# EAGLE design Relay 4 Channel (EAGLE 7.2.0)
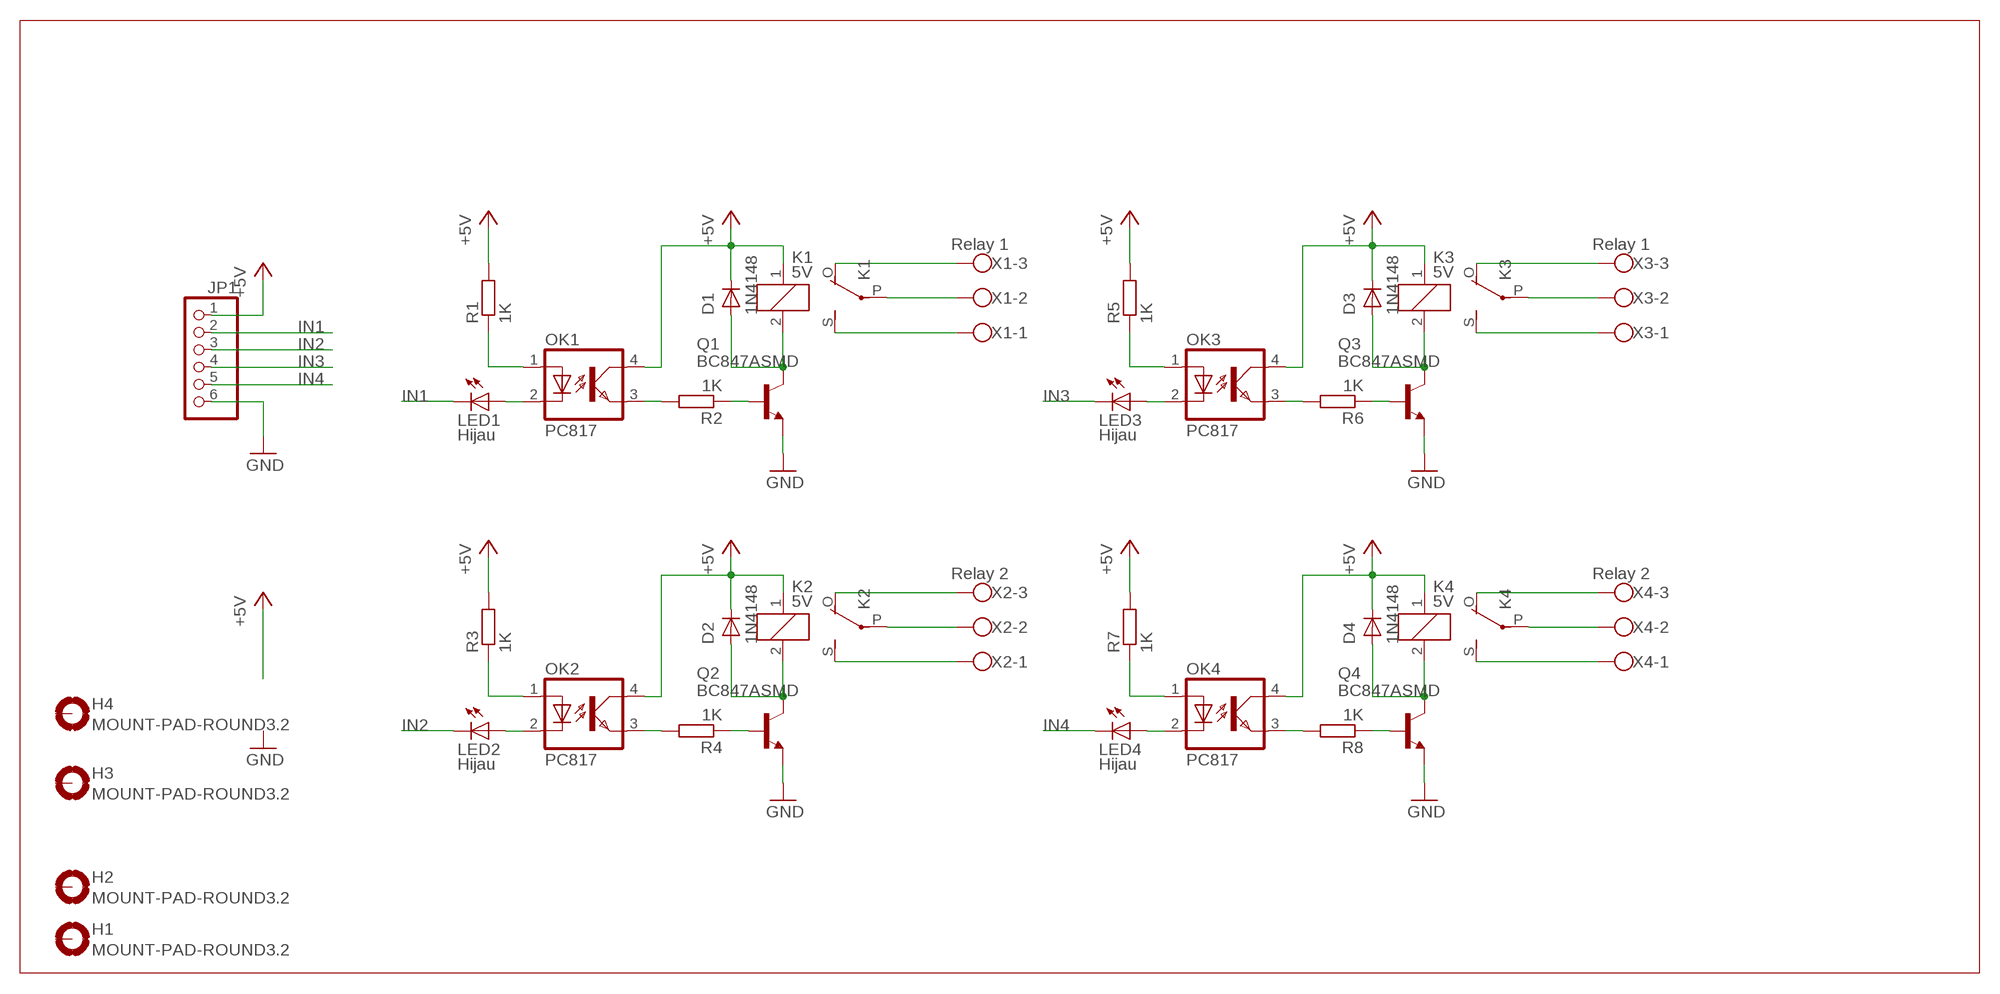
[diagram p0: schematic, sheet 1]

## Parts
D1  1N4148  GF1  [SMA-DO214AC]
D2  1N4148  GF1  [SMA-DO214AC]
D3  1N4148  GF1  [SMA-DO214AC]
D4  1N4148  GF1  [SMA-DO214AC]
H1  MOUNT-PAD-ROUND3.2  [3,2-PAD]
H2  MOUNT-PAD-ROUND3.2  [3,2-PAD]
H3  MOUNT-PAD-ROUND3.2  [3,2-PAD]
H4  MOUNT-PAD-ROUND3.2  [3,2-PAD]
JP1  PINHD-1X6  [1X06]
K1  5V  ZF112  [ZF112]
K2  5V  ZF112  [ZF112]
K3  5V  ZF112  [ZF112]
K4  5V  ZF112  [ZF112]
LED1  Hijau  LED3MM  [LED3MM]
LED2  Hijau  LED3MM  [LED3MM]
LED3  Hijau  LED3MM  [LED3MM]
LED4  Hijau  LED3MM  [LED3MM]
OK1  PC817  [DIL04]
OK2  PC817  [DIL04]
OK3  PC817  [DIL04]
OK4  PC817  [DIL04]
Q1  BC847ASMD  [SOT23]
Q2  BC847ASMD  [SOT23]
Q3  BC847ASMD  [SOT23]
Q4  BC847ASMD  [SOT23]
R1  1K  R-EU_R1206  [R1206]
R2  1K  R-EU_R1206  [R1206]
R3  1K  R-EU_R1206  [R1206]
R4  1K  R-EU_R1206  [R1206]
R5  1K  R-EU_R1206  [R1206]
R6  1K  R-EU_R1206  [R1206]
R7  1K  R-EU_R1206  [R1206]
R8  1K  R-EU_R1206  [R1206]
X1  Relay 1  W237-103  [W237-103]
X2  Relay 2  W237-103  [W237-103]
X3  Relay 1  W237-103  [W237-103]
X4  Relay 2  W237-103  [W237-103]

## Nets
+5V: D1.K(C) D2.K(C) D3.K(C) D4.K(C) JP1.1 K1.1 K2.1 K3.1 K4.1 OK1.4(COL) OK2.4(COL) OK3.4(COL) OK4.4(COL) R1.2 R3.2 R5.2 R7.2
GND: JP1.6 Q1.2(E) Q2.2(E) Q3.2(E) Q4.2(E)
IN1: JP1.2 LED1.K(C)
IN2: JP1.3 LED2.K(C)
IN3: JP1.4 LED3.K(C)
IN4: JP1.5 LED4.K(C)
N$1: LED1.A OK1.2(C)
N$2: K1.O(2:O) X1.3
N$3: K1.P(2:P) X1.2
N$4: K1.S(2:S) X1.1
N$5: OK1.1(A) R1.1
N$6: LED3.A OK3.2(C)
N$7: OK1.3(EMIT) R2.2
N$8: D1.A K1.2 Q1.3(C)
N$9: Q1.1(B) R2.1
N$10: LED2.A OK2.2(C)
N$11: K2.O(2:O) X2.3
N$12: K2.P(2:P) X2.2
N$13: K2.S(2:S) X2.1
N$14: OK2.1(A) R3.1
N$15: K3.O(2:O) X3.3
N$16: OK2.3(EMIT) R4.2
N$17: D2.A K2.2 Q2.3(C)
N$18: Q2.1(B) R4.1
N$19: K3.P(2:P) X3.2
N$20: K3.S(2:S) X3.1
N$21: OK3.1(A) R5.1
N$22: OK3.3(EMIT) R6.2
N$23: D3.A K3.2 Q3.3(C)
N$24: Q3.1(B) R6.1
N$25: LED4.A OK4.2(C)
N$26: K4.O(2:O) X4.3
N$27: K4.P(2:P) X4.2
N$28: K4.S(2:S) X4.1
N$29: OK4.1(A) R7.1
N$30: OK4.3(EMIT) R8.2
N$31: D4.A K4.2 Q4.3(C)
N$32: Q4.1(B) R8.1
Unconnected: H1.B3,2(MOUNT) H2.B3,2(MOUNT) H3.B3,2(MOUNT) H4.B3,2(MOUNT)

## Library data of the parts
D1-D4 = diode:GF1: DIODE
H1-H4 = holes:MOUNT-PAD-ROUND: MOUNTING PAD, round
JP1 = pinhead:PINHD-1X6: PIN HEADER
K1-K4 = relay:ZF112: RELAY 1 x switch; OC_FARNELL: unknown; OC_NEWARK: unknown
LED1-LED4 = led:LED: LED OSRAM: - CHIPLED LG R971, LG N971, LY N971, LG Q971, LY Q971, LO R971, LY R971 LH N974, LH R974 LS Q976, LO Q976, LY Q976 LO Q996 - Hyper CHIPLED LW Q18S LB Q993, LB Q99A, LB R99A - SideLED LS A670, LO A670, LY A670, LG A670, LP A670 LB A673, LV A673, LT A673, LW A673 LH A674 LY A675 LS A676, LA A676, LO A676, LY A676, LW A676 LS A679, LY A679, LG A679 - Hyper Micro SIDELED® LS Y876, LA Y876, LO Y876, LY Y876 LT Y87S - SmartLED LW L88C, LW L88S LB L89C, LB L89S, LG L890 LS L89K, LO L89K, LY L89K LS L896, LA L896, LO L896, LY L896 - TOPLED LS T670, LO T670, LY T670, LG T670, LP T670 LSG T670, LSP T670, LSY T670, LOP T670, LYG T670 LG T671, LOG T671, LSG T671 LB T673, LV T673, LT T673, LW T673 LH T674 LS T676, LA T676, LO T676, LY T676, LB T676, LH T676, LSB T676, LW T676 LB T67C, LV T67C, LT T67C, LS T67K, LO T67K, LY T67K, LW E67C LS E67B, LA E67B, LO E67B, LY E67B, LB E67C, LV E67C, LT E67C LW T67C LS T679, LY T679, LG T679 LS T770, LO T770, LY T770, LG T770, LP T770 LB T773, LV T773, LT T773, LW T773 LH T774 LS E675, LA E675, LY E675, LS T675 LS T776, LA T776, LO T776, LY T776, LB T776 LHGB T686 LT T68C, LB T68C - Hyper Mini TOPLED® LB M676 - Mini TOPLED Santana® LG M470 LS M47K, LO M47K, LY M47K Source: http://www.osram.convergy.de LUXEON: - LUMILED® LXK2-PW12-R00, LXK2-PW12-S00, LXK2-PW14-U00, LXK2-PW14-V00 LXK2-PM12-R00, LXK2-PM12-S00, LXK2-PM14-U00 LXK2-PE12-Q00, LXK2-PE12-R00, LXK2-PE12-S00, LXK2-PE14-T00, LXK2-PE14-U00 LXK2-PB12-K00, LXK2-PB12-L00, LXK2-PB12-M00, LXK2-PB14-N00, LXK2-PB14-P00, LXK2-PB14-Q00 LXK2-PR12-L00, LXK2-PR12-M00, LXK2-PR14-Q00, LXK2-PR14-R00 LXK2-PD12-Q00, LXK2-PD12-R00, LXK2-PD12-S00 LXK2-PH12-R00, LXK2-PH12-S00 LXK2-PL12-P00, LXK2-PL12-Q00, LXK2-PL12-R00 Source: www.luxeon.com KINGBRIGHT: KA-3528ASYC Source: www.kingbright.com
OK1-OK4 = optocoupler:PC817: SHARP OPTO COUPLER; MPN: PC817X4J000F; OC_FARNELL: 9707727; OC_NEWARK: 97K7059
Q1-Q4 = transistor-npn:BC847*: NPN Transistor
R1-R8 = rcl:R-EU_: RESISTOR, European symbol
X1-X4 = con-wago-500:W237-103: WAGO SCREW CLAMP; MPN: 237-103; OC_FARNELL: unknown; OC_NEWARK: 18M7116

## Board
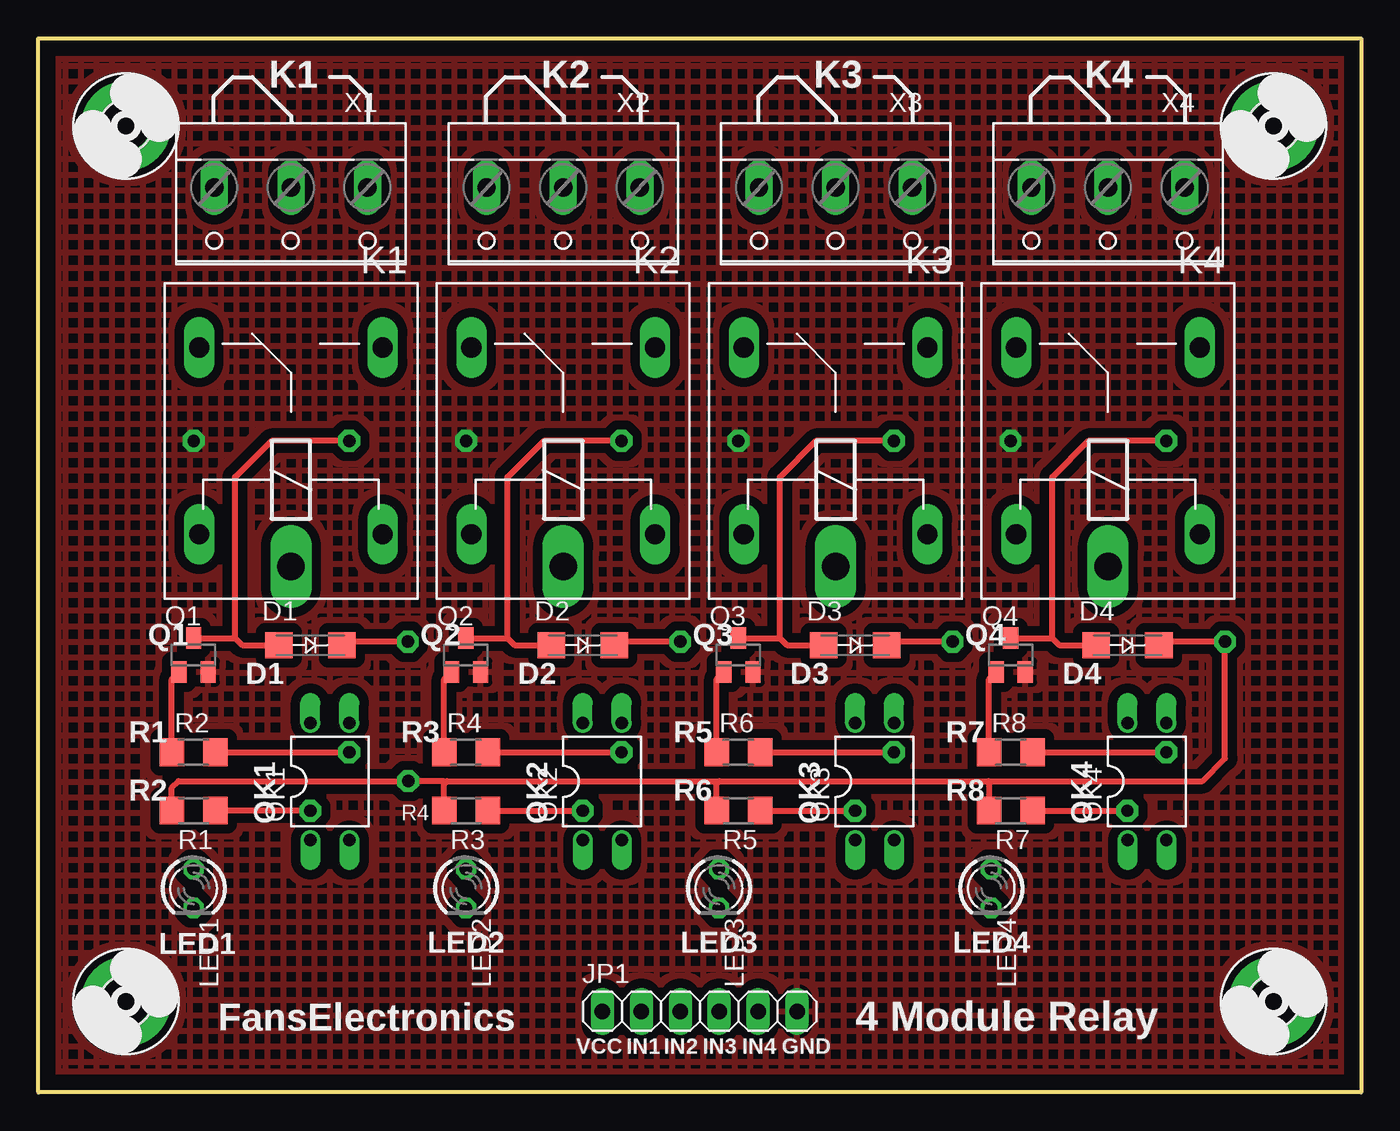
[diagram p1: board, top side]
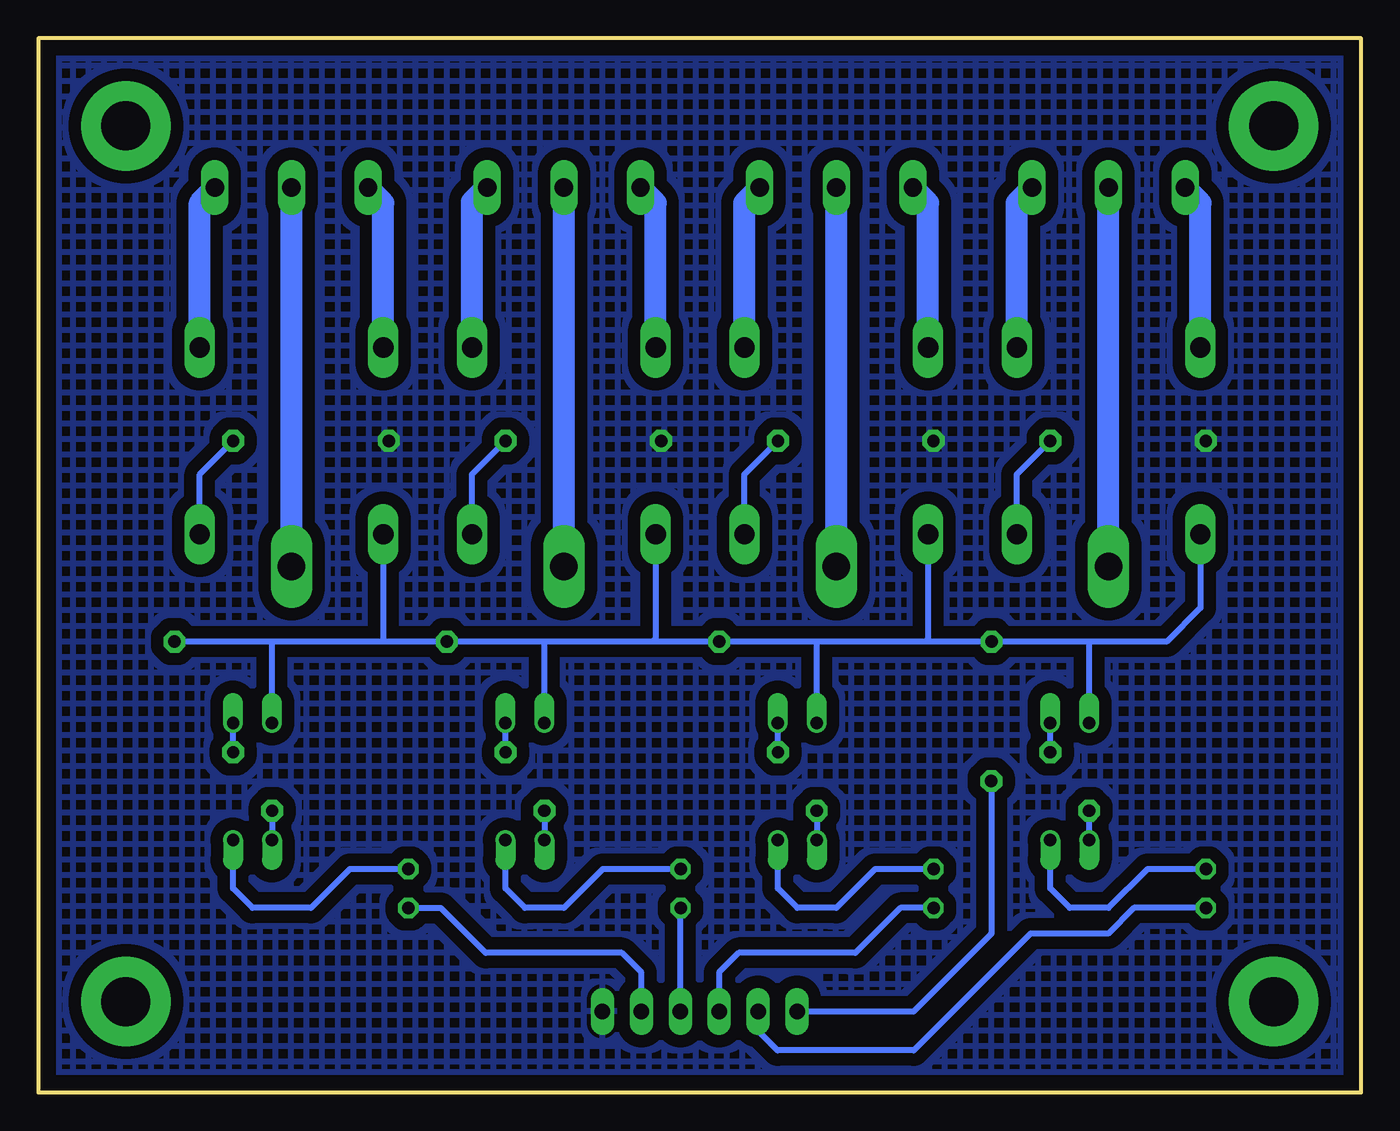
[diagram p2: board, bottom side, seen from below]

Size 86.36 x 68.78 mm. Coordinates in mm from the lower left corner, seen from the top.
Outline: 0,0 0,68.78 86.36,68.78 86.36,0 0,0
Copper layers (1*16): Top 0.035mm / dielectric 1.5mm / Bottom 0.035mm
Design rules "default": minimum track width 10mil, minimum drill 24mil, track to track 8mil, track to pad 8mil, pad to pad 8mil, via to via 8mil, smd to smd 8mil, copper to edge 40mil, drill to drill 8mil, minimum pad ring 10mil, minimum via ring 8mil, stop-mask expansion 4mil, vias tented up to drill 0mil, thermal gap 10mil

### Footprints (pad centres in the part's own frame; a part is rotated, then mirrored left to right if it is on the bottom)
SMA-DO214AC = smd 1.8 x 1.7: A -2.05,0; K 2.05,0
3,2-PAD = drill 3.2 pad 5.842: B3,2 0,0
1X06 = drill 1.016 long: 1 -6.35,0; 2 -3.81,0; 3 -1.27,0; 4 1.27,0; 5 3.81,0; 6 6.35,0
ZF112 = drill 1.321 long: 1 -6.096,5.994; 2 -6.096,-5.994; O 6.096,5.994; S 6.096,-5.994 | drill 1.803 long: P -8.204,0
LED3MM = drill 0.813 octagon: A -1.27,0; K 1.27,0
DIL04 = drill 0.813 offset: 1 -1.27,-3.81; 2 1.27,-3.81; 3 1.27,3.81; 4 -1.27,3.81
SOT23 = smd 1 x 1.4: 1 -0.95,-1.1; 2 0.95,-1.1; 3 0,1.1
R1206 = smd 1.6 x 1.803: 1 -1.422,0; 2 1.422,0
W237-103 = drill 1.194 long: 1 -5,-1.29; 2 0,-1.29; 3 5,-1.29

### Placement (x,y rotation side)
D1  17.76,29.17 0 top
D2  35.54,29.17 0 top
D3  53.32,29.17 0 top
D4  71.1,29.17 0 top
H1  5.71,5.91 0 top
H2  80.65,5.91 0 top
H3  5.71,63.06 0 top
H4  80.65,63.06 0 top
JP1  43.18,5.28 0 top
K1  16.49,42.51 90 top
K2  34.27,42.51 90 top
K3  52.05,42.51 90 top
K4  69.83,42.51 90 top
LED1  10.14,13.3 270 top
LED2  27.92,13.3 270 top
LED3  44.43,13.3 270 top
LED4  62.21,13.3 270 top
OK1  19.03,20.28 0 top
OK2  36.81,20.28 0 top
OK3  54.59,20.28 0 top
OK4  72.37,20.28 0 top
Q1  10.14,28.54 0 top
Q2  27.92,28.54 0 top
Q3  45.7,28.54 0 top
Q4  63.48,28.54 0 top
R1  10.14,18.38 180 top
R2  10.14,22.19 0 top
R3  27.92,18.38 180 top
R4  27.92,22.19 0 top
R5  45.7,18.38 180 top
R6  45.7,22.19 0 top
R7  63.48,18.38 180 top
R8  63.48,22.19 0 top
X1  16.49,57.75 180 top
X2  34.27,57.75 180 top
X3  52.05,57.75 180 top
X4  69.83,57.75 180 top

### Tracks (layer width: path | path; a pad name or v marks a point on that pad's centre or on a via)
+5V  (via drill 0.8 pad 1.42)
  Top 0.406: D4.K 73.39,29.41 v77.47,29.41 77.47,21.79 75.99,20.31 62.05,20.31 | v24.13,29.41 20.05,29.41 D1.K | v41.91,29.41 37.82,29.41 D2.K | v59.69,29.41 55.6,29.41 D3.K | R1.2 8.72,19.88 9.15,20.31 v24.15,20.31 26.45,20.31 | 26.45,20.31 26.67,20.31 | 26.67,20.31 44.45,20.31 | 44.45,20.31 62.05,20.31 | 62.05,20.31 R7.2 | 26.67,20.31 26.5,20.14 R3.2 26.5,20.26 26.45,20.31 | R5.2 44.28,20.14 44.45,20.31
  Bottom 0.406: K1.1 10.5,31.61 12.7,29.41 17.78,29.41 | 28.45,29.41 v24.13,29.41 17.78,29.41 | 28.45,29.41 35.56,29.41 | 46.25,29.41 v41.91,29.41 35.56,29.41 | 46.25,29.41 53.34,29.41 | 63.85,29.41 v59.69,29.41 53.34,29.41 | 63.85,29.41 71.12,29.41 | 71.12,29.41 v77.47,29.41 | K2.1 28.28,29.58 28.45,29.41 | K3.1 46.06,29.6 46.25,29.41 | K4.1 63.84,29.42 63.85,29.41 | OK1.4 17.76,29.39 17.78,29.41 | OK2.4 35.54,29.39 35.56,29.41 | OK3.4 53.32,29.39 53.34,29.41 | OK4.4 71.1,29.39 71.12,29.41 | v24.15,20.31 24.15,10.38 24.13,10.36 29.21,5.28 JP1.1
GND  (via drill 0.8 pad 1.42)
  other vias: 10.14,42.51 27.92,42.51 45.7,42.51 63.48,42.51
  pour Bottom (isolate 0.813, hatched): -0.02,69.18 86.34,69.18 86.34,0.6 -0.02,0.6
  pour Top (isolate 0.61, hatched): -0.02,69.18 86.34,69.18 86.34,0.6 -0.02,0.6
IN1
  Bottom 0.406: JP1.2 39.37,4.01 38.1,2.74 29.21,2.74 21.59,10.36 16.51,10.36 14.84,12.03 LED1.K
IN2
  Bottom 0.406: LED2.K 30.08,12.03 33.02,9.09 40.64,9.09 41.91,7.82 JP1.3
IN3
  Bottom 0.406: JP1.4 44.45,12.01 LED3.K
IN4
  Bottom 0.406: JP1.5 46.99,7.82 48.26,9.09 57.15,9.09 60.09,12.03 LED4.K
N$1
  Bottom 0.406: LED1.A 13.95,14.57 16.49,12.03 19.03,12.03 20.3,13.3 OK1.2
N$2
  Bottom 1.422: K1.O 10.5,58.05 X1.3
N$3
  Bottom 1.422: K1.P X1.2
N$4
  Bottom 1.422: K1.S 22.48,58.05 X1.1
N$5  (via drill 0.8 pad 1.42)
  Top 0.406: v17.76,18.38 R1.1
  Bottom 0.406: OK1.1 v17.76,18.38
N$6
  Bottom 0.406: LED3.A 49.51,14.57 52.05,12.03 54.59,12.03 55.86,13.3 OK3.2
N$7  (via drill 0.8 pad 1.42)
  Top 0.406: R2.2 v20.3,22.19
  Bottom 0.406: v20.3,22.19 OK1.3
N$8  (via drill 0.8 pad 1.42)
  Top 0.406: Q1.3 12.85,29.64 | 12.85,29.64 13.31,29.17 D1.A | v20.3,42.51 15.22,42.51 12.85,40.14 12.85,29.64
  Bottom 0.406: K1.2 22.48,40.33 v20.3,42.51
N$9
  Top 0.406: R2.1 8.72,26.97 Q1.1
N$10
  Bottom 0.406: LED2.A 31.73,14.57 34.27,12.03 36.81,12.03 38.08,13.3 OK2.2
N$11
  Bottom 1.422: K2.O 28.28,58.05 X2.3
N$12
  Bottom 1.422: K2.P X2.2
N$13
  Bottom 1.422: K2.S 40.26,58.05 X2.1
N$14  (via drill 0.8 pad 1.42)
  Top 0.406: R3.1 v35.54,18.38
  Bottom 0.406: v35.54,18.38 OK2.1
N$15
  Bottom 1.422: K3.O 46.06,58.05 X3.3
N$16  (via drill 0.8 pad 1.42)
  Top 0.406: R4.2 v38.08,22.19
  Bottom 0.406: v38.08,22.19 OK2.3
N$17  (via drill 0.8 pad 1.42)
  Top 0.406: Q2.3 30.63,29.64 | 30.63,29.64 31.09,29.17 D2.A | v38.08,42.51 33,42.51 30.63,40.14 30.63,29.64
  Bottom 0.406: K2.2 40.26,40.33 v38.08,42.51
N$18
  Top 0.406: R4.1 26.5,26.97 Q2.1
N$19
  Bottom 1.422: K3.P X3.2
N$20
  Bottom 0.254: 57.13,59.02 57.07,59.02 X3.1
  Bottom 1.422: K3.S 58.04,58.11 57.13,59.02
N$21  (via drill 0.8 pad 1.42)
  Top 0.406: R5.1 v53.32,18.38
  Bottom 0.406: v53.32,18.38 OK3.1
N$22  (via drill 0.8 pad 1.42)
  Top 0.406: R6.2 v55.86,22.19
  Bottom 0.406: v55.86,22.19 OK3.3
N$23  (via drill 0.8 pad 1.42)
  Top 0.406: Q3.3 48.41,29.64 | 48.41,29.64 48.88,29.17 D3.A | v55.86,42.51 50.78,42.51 48.41,40.14 48.41,29.64
  Bottom 0.406: K3.2 58.04,40.33 v55.86,42.51
N$24
  Top 0.406: R6.1 44.28,26.97 Q3.1
N$25
  Bottom 0.406: LED4.A 66.02,14.57 68.56,12.03 72.37,12.03 73.64,13.3 OK4.2
N$26
  Bottom 1.422: K4.O 63.84,58.05 X4.3
N$27
  Bottom 1.422: K4.P X4.2
N$28
  Bottom 1.422: K4.S 75.82,58.05 X4.1
N$29  (via drill 0.8 pad 1.42)
  Top 0.406: R7.1 v71.1,18.38
  Bottom 0.406: v71.1,18.38 OK4.1
N$30  (via drill 0.8 pad 1.42)
  Top 0.406: R8.2 v73.64,22.19
  Bottom 0.406: v73.64,22.19 OK4.3
N$31  (via drill 0.8 pad 1.42)
  Top 0.406: Q4.3 66.19,29.64 | 66.19,29.64 66.66,29.17 D4.A | v73.64,42.51 68.56,42.51 66.19,40.14 66.19,29.64
  Bottom 0.406: K4.2 75.82,40.33 v73.64,42.51
N$32
  Top 0.406: R8.1 62.06,26.97 Q4.1

### Text on the board
tPlace: K1 | K2 | K3 | K4 | Q1 | Q2 | Q3 | Q4 | D1 | D2 | D3 | D4 | R1 | R3 | R5 | R7 | R2 | R6 | R8 | OK1 | R4 | OK2 | OK3 | OK4 | LED1 | LED2 | LED3 | LED4 | FansElectronics | 4 Module Relay | VCC | IN1 | IN2 | IN3 | IN4 | GND